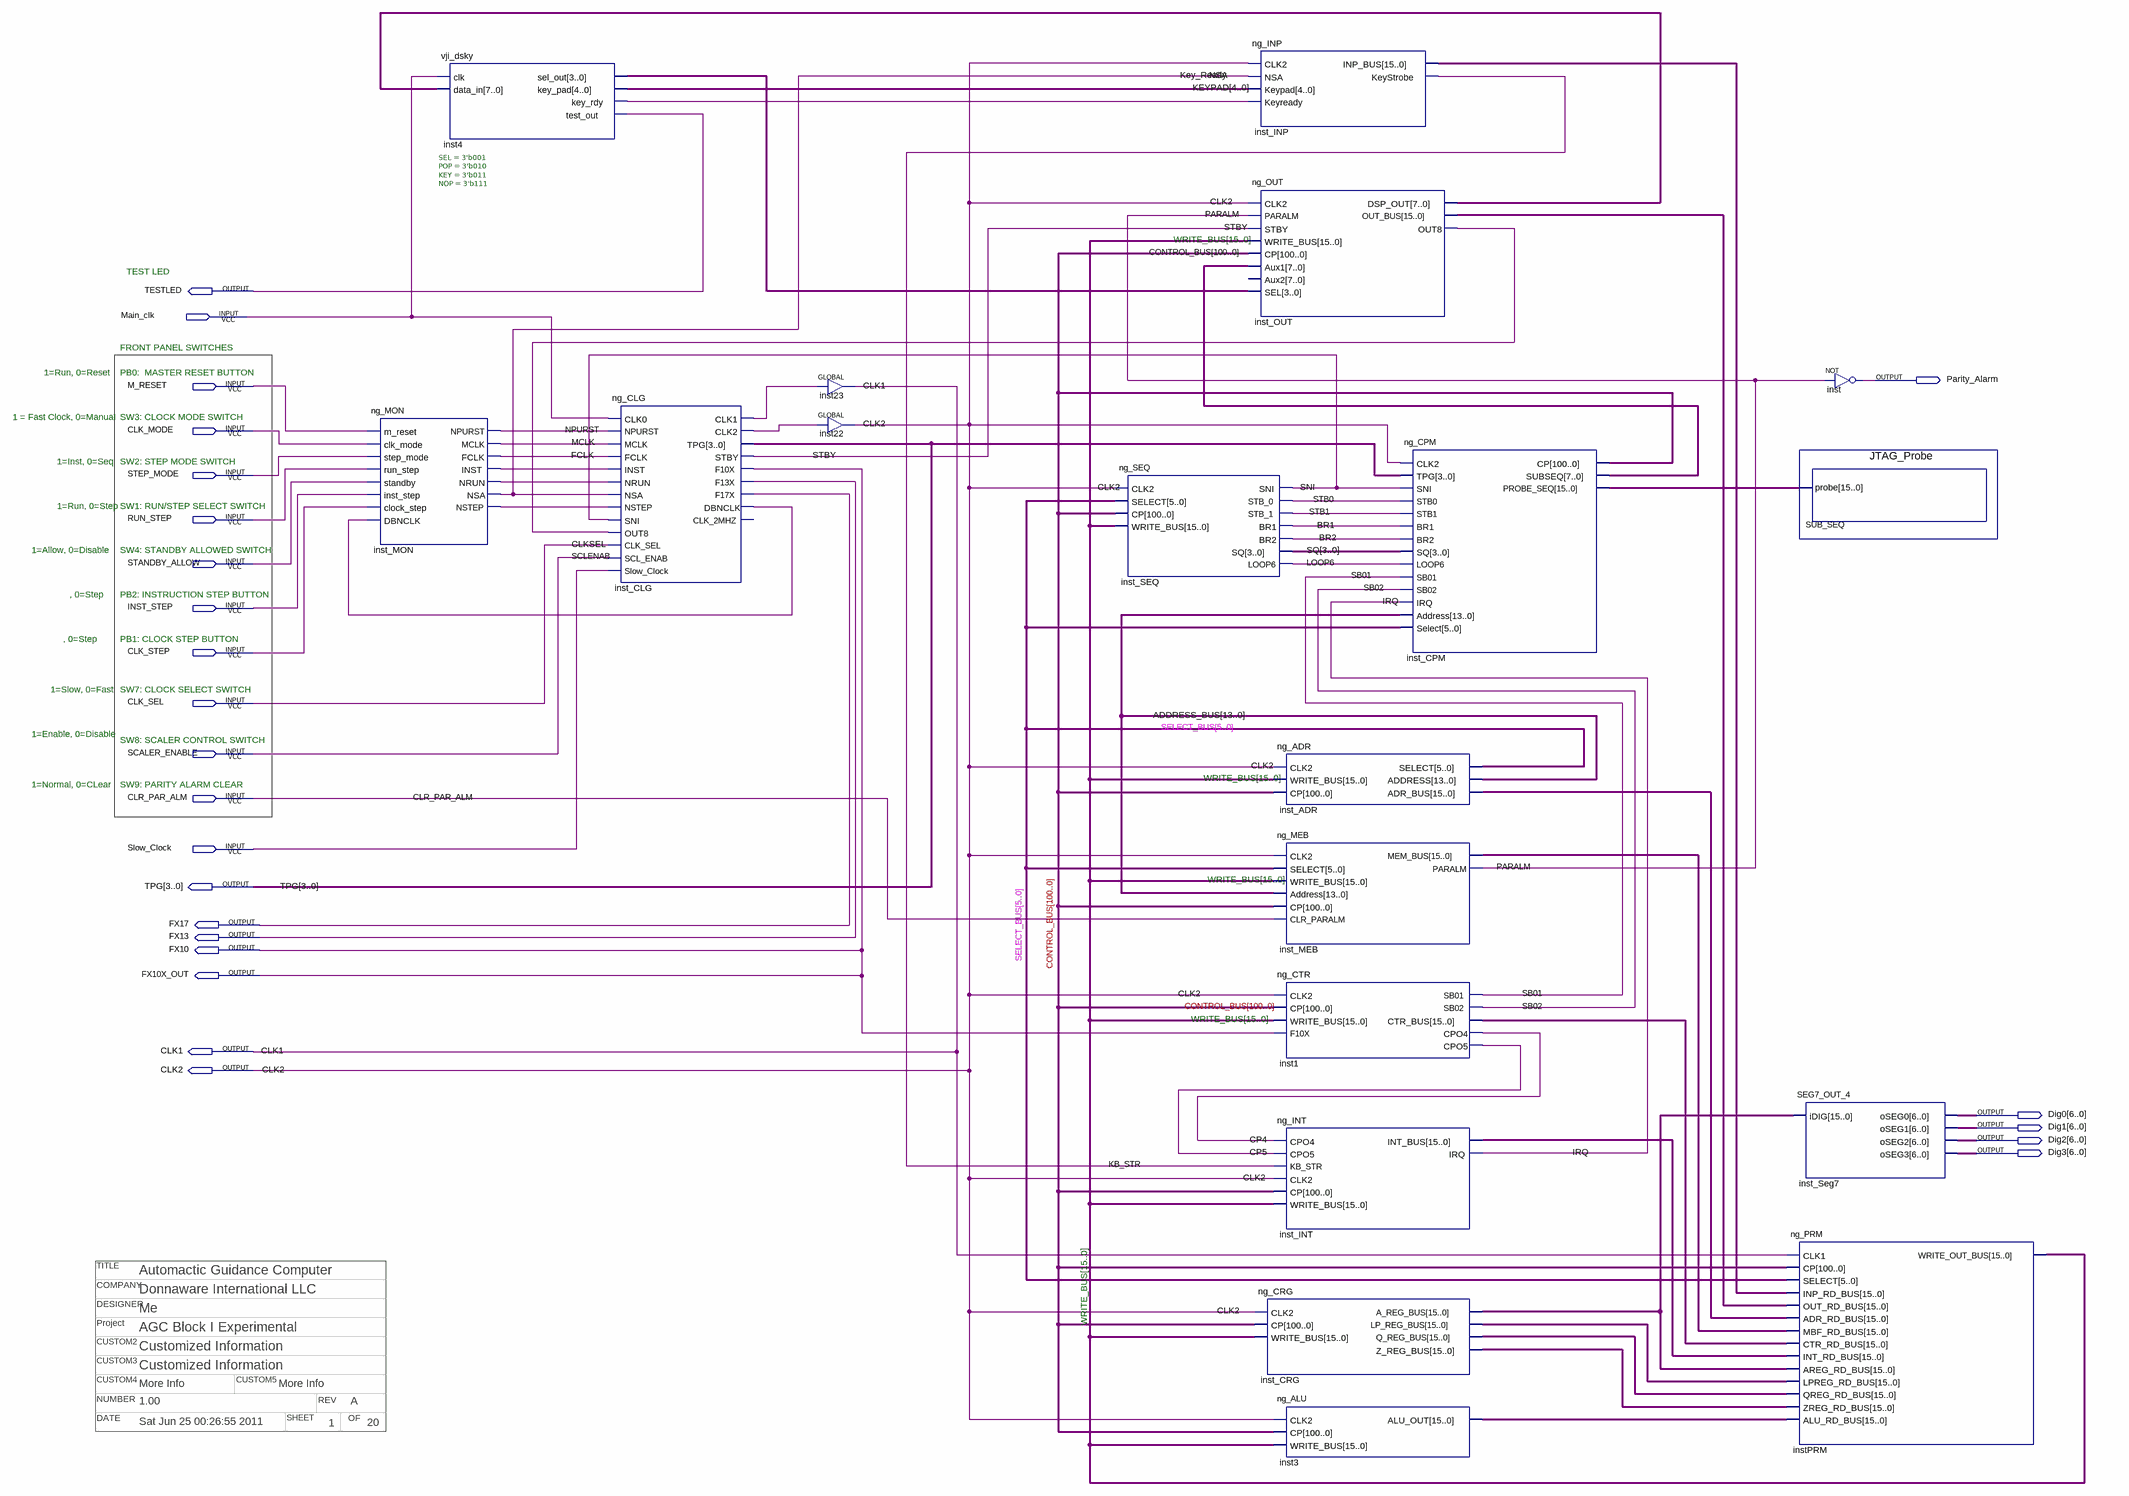
[diagram p0: schematic sheet]
// Quartus schematic AGC.bdf as structural Verilog: 19 symbols, 25 pins
// Title block: COMPANY: Donnaware International LLC; Project: AGC Block I Experimental; CUSTOM2: Customized Information; CUSTOM3: Customized Information; CUSTOM4: More Info; CUSTOM5: More Info; DATE: Sat Jun 25 00:26:55 2011; DESIGNER: Me; NUMBER: 1.00; OF: 20; REV: A; SHEET: 1; TITLE: Automactic Guidance Computer
module AGC (
  input  Main_clk,
  input  M_RESET,
  input  CLK_MODE,
  input  STEP_MODE,
  input  RUN_STEP,
  input  STANDBY_ALLOW,
  input  INST_STEP,
  input  CLK_STEP,
  input  CLK_SEL,
  input  SCALER_ENABLE,
  input  CLR_PAR_ALM,
  input  Slow_Clock,
  output TESTLED,
  output Parity_Alarm,
  output [3:0] TPG,
  output FX17,
  output FX13,
  output FX10,
  output FX10X_OUT,
  output CLK1,
  output CLK2,
  output [6:0] Dig0,
  output [6:0] Dig1,
  output [6:0] Dig2,
  output [6:0] Dig3
);

  wire BR1, BR2, CP4, CP5, FCLK, inst_CLG_clk1, inst_CLG_clk2, inst_CLG_dbnclk, inst_MON_inst, inst_MON_nrun,
       inst_MON_nstep, inst_OUT_out8, IRQ, KB_STR, Key_Ready, LOOP6, MCLK, NPURST, NSA, PARALM, SB01, SB02,
       SNI, STB0, STB1, STBY;
  wire [3:0] inst4_sel_out, SQ;
  wire [4:0] KEYPAD;
  wire [5:0] SELECT_BUS;
  wire [7:0] inst_CPM_subseq, inst_OUT_dsp_out;
  wire [13:0] ADDRESS_BUS;
  wire [15:0] inst1_ctr_bus, inst3_alu_out, inst_ADR_adr_bus, inst_CPM_probe_seq, inst_CRG_a_reg_bus,
       inst_CRG_lp_reg_bus, inst_CRG_q_reg_bus, inst_CRG_z_reg_bus, inst_INP_inp_bus, inst_INT_int_bus,
       inst_MEB_mem_bus, inst_OUT_out_bus, WRITE_BUS;
  wire [100:0] CONTROL_BUS;

  ng_MON inst_MON (
    .m_reset(M_RESET), .clk_mode(CLK_MODE), .step_mode(STEP_MODE), .run_step(RUN_STEP),
    .standby(STANDBY_ALLOW), .inst_step(INST_STEP), .clock_step(CLK_STEP), .DBNCLK(inst_CLG_dbnclk),
    .NPURST(NPURST), .MCLK(MCLK), .FCLK(FCLK), .INST(inst_MON_inst), .NRUN(inst_MON_nrun), .NSA(NSA),
    .NSTEP(inst_MON_nstep));
  vji_dsky #(.SEL(3'b001), .POP(3'b010), .KEY(3'b011), .NOP(3'b111)) inst4 (
    .clk(Main_clk), .data_in(inst_OUT_dsp_out), .sel_out(inst4_sel_out), .key_pad(KEYPAD),
    .key_rdy(Key_Ready), .test_out(TESTLED));
  ng_CLG inst_CLG (
    .CLK0(Main_clk), .NPURST(NPURST), .MCLK(MCLK), .FCLK(FCLK), .INST(inst_MON_inst), .NRUN(inst_MON_nrun),
    .NSA(NSA), .NSTEP(inst_MON_nstep), .SNI(SNI), .OUT8(inst_OUT_out8), .CLK_SEL(CLK_SEL),
    .SCL_ENAB(SCALER_ENABLE), .Slow_Clock(Slow_Clock), .CLK1(inst_CLG_clk1), .CLK2(inst_CLG_clk2), .TPG(TPG),
    .STBY(STBY), .F10X(FX10), .F13X(FX13), .F17X(FX17), .DBNCLK(inst_CLG_dbnclk));  // open: CLK_2MHZ
  GLOBAL inst23 (.IN(inst_CLG_clk1), .OUT(CLK1));
  GLOBAL inst22 (.IN(inst_CLG_clk2), .OUT(CLK2));
  ng_SEQ inst_SEQ (
    .CLK2(CLK2), .SELECT(SELECT_BUS), .CP(CONTROL_BUS), .WRITE_BUS(WRITE_BUS), .SNI(SNI), .STB_0(STB0),
    .STB_1(STB1), .BR1(BR1), .BR2(BR2), .SQ(SQ), .LOOP6(LOOP6));
  ng_INP inst_INP (
    .CLK2(CLK2), .NSA(NSA), .Keypad(KEYPAD), .Keyready(Key_Ready), .INP_BUS(inst_INP_inp_bus),
    .KeyStrobe(KB_STR));
  ng_OUT inst_OUT (
    .CLK2(CLK2), .PARALM(PARALM), .STBY(STBY), .WRITE_BUS(WRITE_BUS), .CP(CONTROL_BUS),
    .Aux1(inst_CPM_subseq), .SEL(inst4_sel_out), .DSP_OUT(inst_OUT_dsp_out), .OUT_BUS(inst_OUT_out_bus),
    .OUT8(inst_OUT_out8));  // open: Aux2
  ng_CRG inst_CRG (
    .CLK2(CLK2), .CP(CONTROL_BUS), .WRITE_BUS(WRITE_BUS), .A_REG_BUS(inst_CRG_a_reg_bus),
    .LP_REG_BUS(inst_CRG_lp_reg_bus), .Q_REG_BUS(inst_CRG_q_reg_bus), .Z_REG_BUS(inst_CRG_z_reg_bus));
  ng_ADR inst_ADR (
    .CLK2(CLK2), .WRITE_BUS(WRITE_BUS), .CP(CONTROL_BUS), .SELECT(SELECT_BUS), .ADDRESS(ADDRESS_BUS),
    .ADR_BUS(inst_ADR_adr_bus));
  ng_MEB inst_MEB (
    .CLK2(CLK2), .SELECT(SELECT_BUS), .WRITE_BUS(WRITE_BUS), .Address(ADDRESS_BUS), .CP(CONTROL_BUS),
    .CLR_PARALM(CLR_PAR_ALM), .MEM_BUS(inst_MEB_mem_bus), .PARALM(PARALM));
  ng_CTR inst1 (
    .CLK2(CLK2), .CP(CONTROL_BUS), .WRITE_BUS(WRITE_BUS), .F10X(FX10), .SB01(SB01), .SB02(SB02),
    .CTR_BUS(inst1_ctr_bus), .CPO4(CP4), .CPO5(CP5));
  ng_INT inst_INT (
    .CPO4(CP4), .CPO5(CP5), .KB_STR(KB_STR), .CLK2(CLK2), .CP(CONTROL_BUS), .WRITE_BUS(WRITE_BUS),
    .INT_BUS(inst_INT_int_bus), .IRQ(IRQ));
  ng_ALU inst3 (.CLK2(CLK2), .CP(CONTROL_BUS), .WRITE_BUS(WRITE_BUS), .ALU_OUT(inst3_alu_out));
  ng_CPM inst_CPM (
    .CLK2(CLK2), .TPG(TPG), .SNI(SNI), .STB0(STB0), .STB1(STB1), .BR1(BR1), .BR2(BR2), .SQ(SQ),
    .LOOP6(LOOP6), .SB01(SB01), .SB02(SB02), .IRQ(IRQ), .Address(ADDRESS_BUS), .Select(SELECT_BUS),
    .CP(CONTROL_BUS), .SUBSEQ(inst_CPM_subseq), .PROBE_SEQ(inst_CPM_probe_seq));
  not inst (Parity_Alarm, PARALM);
  JTAG_Probe SUB_SEQ (.probe(inst_CPM_probe_seq));
  SEG7_OUT_4 inst_Seg7 (.iDIG(inst_CRG_a_reg_bus), .oSEG0(Dig0), .oSEG1(Dig1), .oSEG2(Dig2), .oSEG3(Dig3));
  ng_PRM instPRM (
    .CLK1(CLK1), .CP(CONTROL_BUS), .SELECT(SELECT_BUS), .INP_RD_BUS(inst_INP_inp_bus),
    .OUT_RD_BUS(inst_OUT_out_bus), .ADR_RD_BUS(inst_ADR_adr_bus), .MBF_RD_BUS(inst_MEB_mem_bus),
    .CTR_RD_BUS(inst1_ctr_bus), .INT_RD_BUS(inst_INT_int_bus), .AREG_RD_BUS(inst_CRG_a_reg_bus),
    .LPREG_RD_BUS(inst_CRG_lp_reg_bus), .QREG_RD_BUS(inst_CRG_q_reg_bus), .ZREG_RD_BUS(inst_CRG_z_reg_bus),
    .ALU_RD_BUS(inst3_alu_out), .WRITE_OUT_BUS(WRITE_BUS));

  assign FX10X_OUT = FX10;

  // Other names for the same wires on the sheet: CLKSEL = CLK_SEL; SCLENAB = SCALER_ENABLE

  // Notes on the sheet:
  //   TEST LED
  //   FRONT PANEL SWITCHES
  //   1=Run, 0=Reset
  //   PB0:  MASTER RESET BUTTON
  //   1 = Fast Clock, 0=Manual
  //   SW3: CLOCK MODE SWITCH
  //   1=Inst, 0=Seq
  //   SW2: STEP MODE SWITCH
  //   1=Run, 0=Step
  //   SW1: RUN/STEP SELECT SWITCH
  //   1=Allow, 0=Disable
  //   SW4: STANDBY ALLOWED SWITCH
  //   , 0=Step
  //   PB2: INSTRUCTION STEP BUTTON
  //   , 0=Step
  //   PB1: CLOCK STEP BUTTON
  //   1=Slow, 0=Fast
  //   SW7: CLOCK SELECT SWITCH
  //   1=Enable, 0=Disable
  //   SW8: SCALER CONTROL SWITCH
  //   1=Normal, 0=CLear
  //   SW9: PARITY ALARM CLEAR
endmodule
